# EAGLE design koppelpunkt (EAGLE 7.3.0)
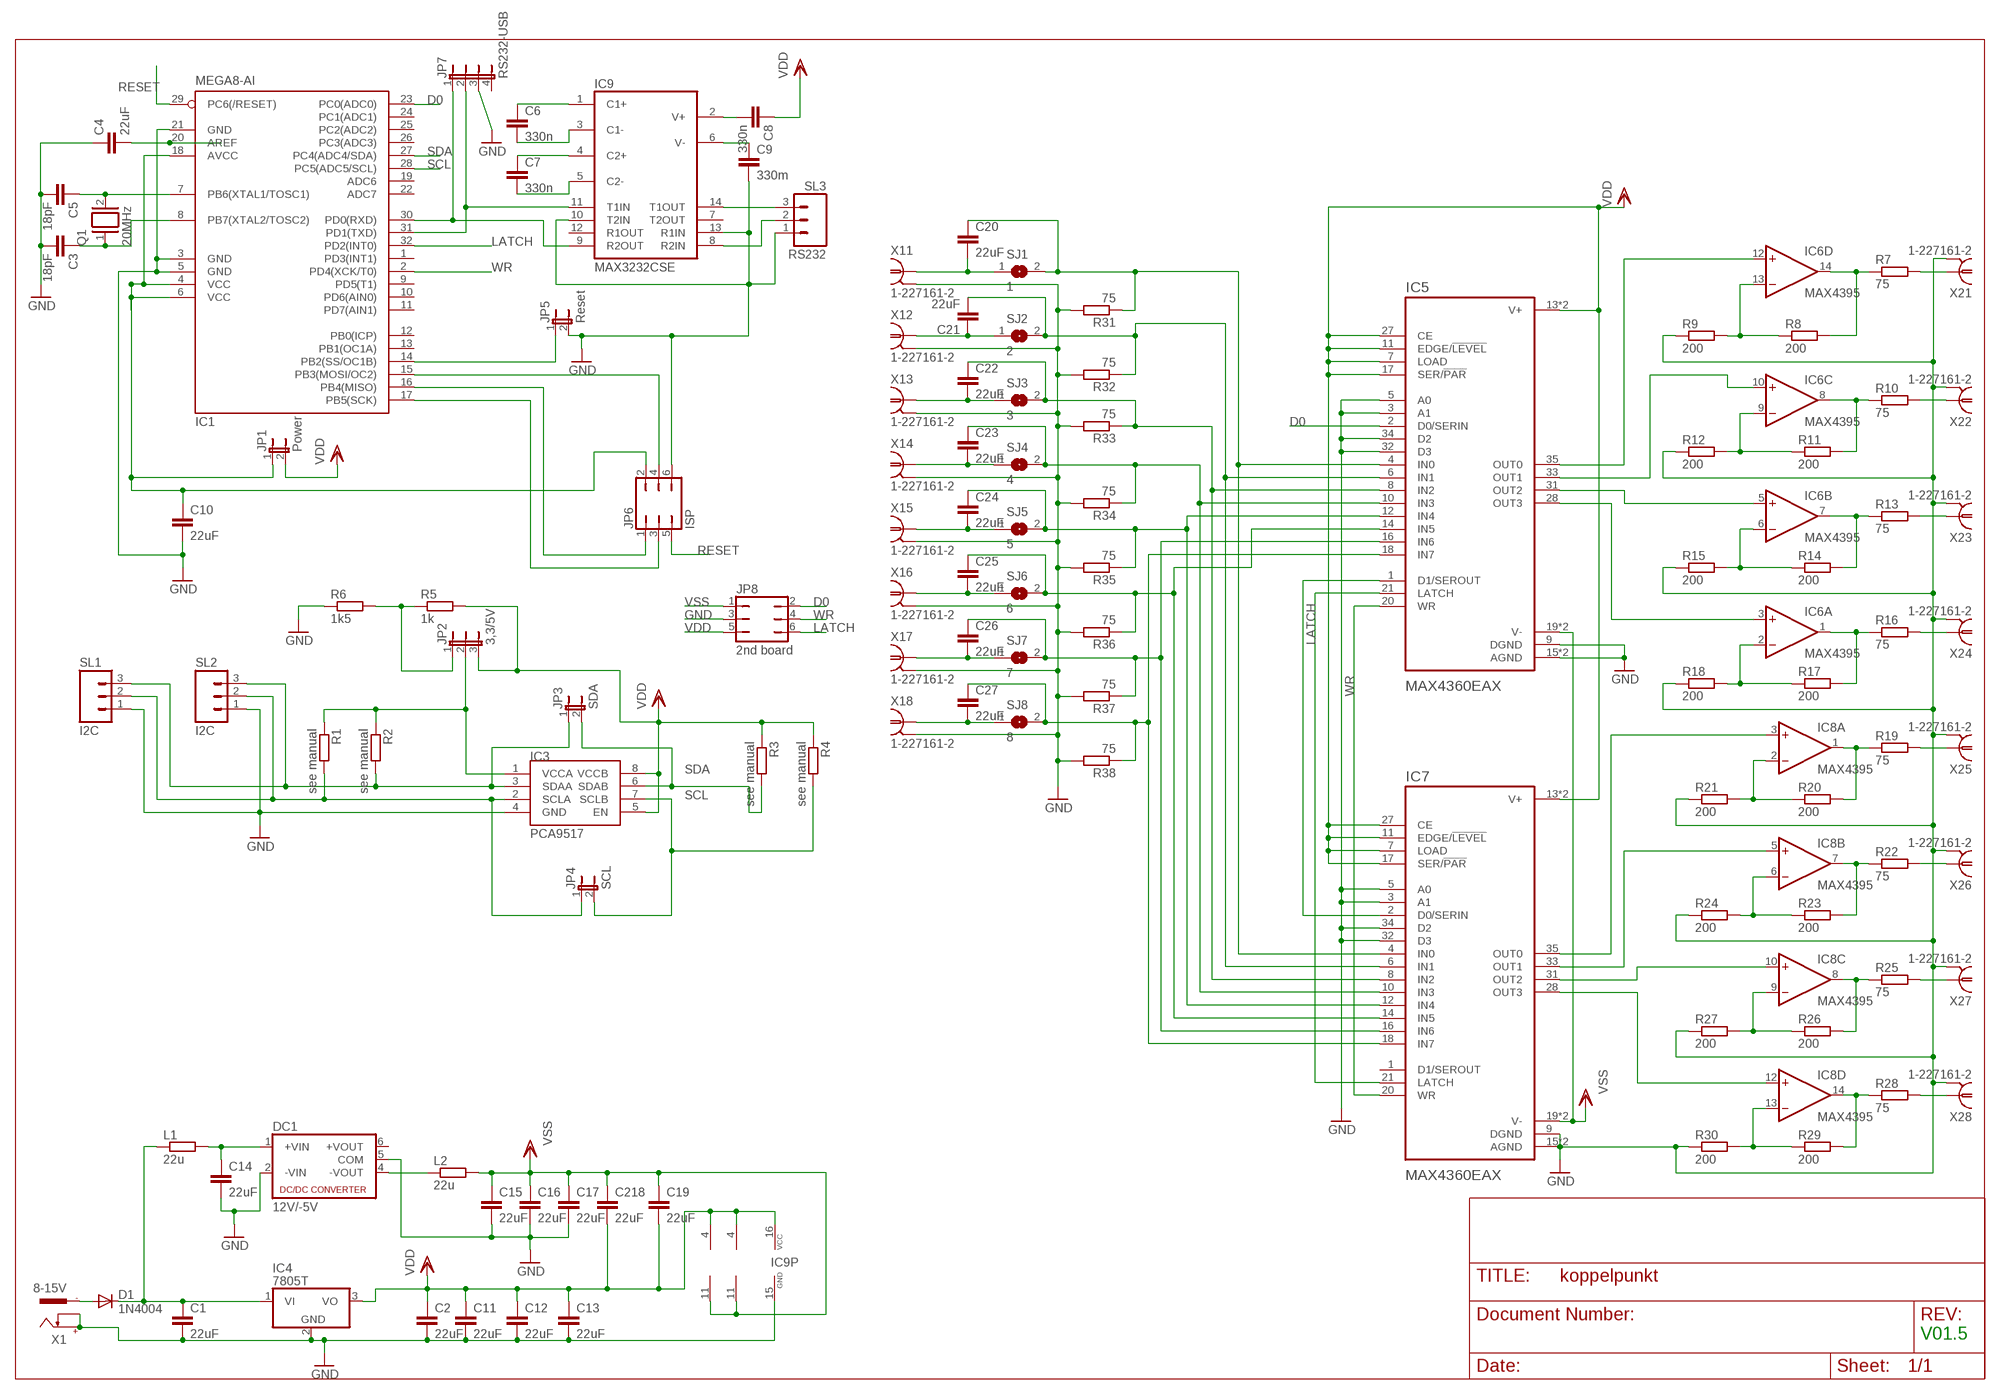
[diagram p0: schematic, sheet 1]

## Parts
C1  22uF  C-EUC1206  [C1206]
C2  22uF  C-EUC1206  [C1206]
C3  18pF  C-EU025-025X050  [C025-025X050]
C4  22uF  C-EUC1206  [C1206]
C5  18pF  C-EU025-025X050  [C025-025X050]
C6  330n  C-EUC1206  [C1206]
C7  330n  C-EUC1206  [C1206]
C8  330n  C-EUC1206  [C1206]
C9  330m  C-EUC1206  [C1206]
C10  22uF  C-EUC1206  [C1206]
C11  22uF  C-EUC1206  [C1206]
C12  22uF  C-EUC1206  [C1206]
C13  22uF  C-EUC1206  [C1206]
C14  22uF  C-EUC1206  [C1206]
C15  22uF  C-EUC1206  [C1206]
C16  22uF  C-EUC1206  [C1206]
C17  22uF  C-EUC1206  [C1206]
C19  22uF  C-EUC1206  [C1206]
C20  22uF  C-EUC1206  [C1206]
C21  22uF  C-EUC1206  [C1206]
C22  22uF  C-EUC1206  [C1206]
C23  22uF  C-EUC1206  [C1206]
C24  22uF  C-EUC1206  [C1206]
C25  22uF  C-EUC1206  [C1206]
C26  22uF  C-EUC1206  [C1206]
C27  22uF  C-EUC1206  [C1206]
C218  22uF  C-EUC1206  [C1206]
D1  1N4004  [DO41-10]
DC1  12V/-5V  NMA  [NMA]
IC1  MEGA8-AI  [TQFP32-08]
IC3  PCA9517  [SO-08]
IC4  7805T  [TO220H]
IC5  MAX4360EAX  [SOP80P1030X264-36N]
IC6  MAX4395  LM324D  [SO14]
IC7  MAX4360EAX  [SOP80P1030X264-36N]
IC8  MAX4395  LM324D  [SO14]
IC9  MAX3232CSE  [SO16]
JP1  Power  JP1E  [JP1]
JP2  3,3/5V  JP2E  [JP2]
JP3  SDA  JP1E  [JP1]
JP4  SCL  JP1E  [JP1]
JP5  Reset  JP1E  [JP1]
JP6  ISP  JP3Q  [JP3Q]
JP7  RS232-USB  JP4E  [JP4]
JP8  2nd board  JP3Q  [JP3Q]
L1  22u  R-EU_R6332  [R6332]
L2  22u  R-EU_R6332  [R6332]
Q1  20MHz  XTAL/S  [QS]
R1  see manual  R-EU_R1206  [R1206]
R2  see manual  R-EU_R1206  [R1206]
R3  see manual  R-EU_R1206  [R1206]
R4  see manual  R-EU_R1206  [R1206]
R5  1k  R-EU_R1206  [R1206]
R6  1k5  R-EU_R1206  [R1206]
R7  75  R-EU_R1206  [R1206]
R8  200  R-EU_R1206  [R1206]
R9  200  R-EU_M1206  [M1206]
R10  75  R-EU_R1206  [R1206]
R11  200  R-EU_R1206  [R1206]
R12  200  R-EU_R1206  [R1206]
R13  75  R-EU_R1206  [R1206]
R14  200  R-EU_R1206  [R1206]
R15  200  R-EU_R1206  [R1206]
R16  75  R-EU_R1206  [R1206]
R17  200  R-EU_R1206  [R1206]
R18  200  R-EU_R1206  [R1206]
R19  75  R-EU_R1206  [R1206]
R20  200  R-EU_R1206  [R1206]
R21  200  R-EU_R1206  [R1206]
R22  75  R-EU_R1206  [R1206]
R23  200  R-EU_R1206  [R1206]
R24  200  R-EU_R1206  [R1206]
R25  75  R-EU_R1206  [R1206]
R26  200  R-EU_R1206  [R1206]
R27  200  R-EU_R1206  [R1206]
R28  75  R-EU_R1206  [R1206]
R29  200  R-EU_R1206  [R1206]
R30  200  R-EU_R1206  [R1206]
R31  75  R-EU_R1206  [R1206]
R32  75  R-EU_R1206  [R1206]
R33  75  R-EU_R1206  [R1206]
R34  75  R-EU_R1206  [R1206]
R35  75  R-EU_R1206  [R1206]
R36  75  R-EU_R1206  [R1206]
R37  75  R-EU_R1206  [R1206]
R38  75  R-EU_R1206  [R1206]
SJ1  1  SJ  [SJ]
SJ2  2  SJ  [SJ]
SJ3  3  SJ  [SJ]
SJ4  4  SJ  [SJ]
SJ5  5  SJ  [SJ]
SJ6  6  SJ  [SJ]
SJ7  7  SJ  [SJ]
SJ8  8  SJ  [SJ]
SL1  I2C  M03  [03P]
SL2  I2C  M03  [03P]
SL3  RS232  M03  [03P]
X1  8-15V  737992-55  [737992-5]
X11  1-227161-2  [AMP_227161]
X12  1-227161-2  [AMP_227161]
X13  1-227161-2  [AMP_227161]
X14  1-227161-2  [AMP_227161]
X15  1-227161-2  [AMP_227161]
X16  1-227161-2  [AMP_227161]
X17  1-227161-2  [AMP_227161]
X18  1-227161-2  [AMP_227161]
X21  1-227161-2  [AMP_227161]
X22  1-227161-2  [AMP_227161]
X23  1-227161-2  [AMP_227161]
X24  1-227161-2  [AMP_227161]
X25  1-227161-2  [AMP_227161]
X26  1-227161-2  [AMP_227161]
X27  1-227161-2  [AMP_227161]
X28  1-227161-2  [AMP_227161]

## Nets
D0: IC1.23(PC0(ADC0)) IC5.2(D0/SERIN) JP8.2
GND: C1.2 C2.2 C3.2 C4.1 C5.2 C9.2 C10.2 C11.2 C12.2 C13.2 C14.2 C15.2 C16.2 C17.2 DC1.2(-VIN) DC1.5(COM) IC1.3(GND) IC1.5(GND) IC1.21(GND) IC3.4(GND) IC4.2(GND) IC5.3(A1) IC5.5(A0) IC5.9(DGND) IC5.15(AGND) IC5.29(AGND) IC5.32(D3) IC5.34(D2) IC7.3(A1) IC7.5(A0) IC7.9(DGND) IC7.15(AGND) IC7.29(AGND) IC7.32(D3) IC7.34(D2) IC9.10(T2IN) IC9.13(R1IN) IC9.15(GND) JP5.2 JP6.6 JP7.3 JP8.3 R6.1 R9.1 R12.1 R15.1 R18.1 R21.1 R24.1 R27.1 R30.1 R31.2 R32.2 R33.2 R34.2 R35.2 R36.2 R37.2 R38.2 SL1.1 SL2.1 SL3.1 X1.+ X1.K X11.2 X12.2 X13.2 X14.2 X15.2 X16.2 X17.2 X18.2 X21.2 X22.2 X23.2 X24.2 X25.2 X26.2 X27.2 X28.2
LATCH: IC1.32(PD2(INT0)) IC5.21(LATCH) IC7.21(LATCH) JP8.6
N$1: C23.1 IC5.10(IN3) IC7.10(IN3) R34.1 SJ4.2
N$2: C5.1 IC1.7(PB6(XTAL1/TOSC1)) Q1.2
N$3: C3.1 IC1.8(PB7(XTAL2/TOSC2)) Q1.1
N$4: C4.2 IC1.20(AREF)
N$5: IC3.3(SDAA) JP3.1 R2.2 SL1.3 SL2.3
N$6: IC1.16(PB4(MISO)) JP6.1
N$7: D1.A X1.-1
N$8: C10.1 IC1.4(VCC) IC1.6(VCC) IC1.18(AVCC) JP1.1 JP6.2
N$9: IC1.17(PB5(SCK)) JP6.3
N$10: IC1.14(PB2(SS/OC1B)) JP5.1
N$11: IC1.15(PB3(MOSI/OC2)) JP6.4
N$12: C7.2 IC9.5(C2-)
N$13: IC3.1(VCCA) JP2.2 R1.1 R2.1
N$14: IC3.2(SCLA) JP4.1 R1.2 SL1.2 SL2.2
N$15: IC9.14(T1OUT) SL3.3
N$16: C8.2 IC9.2(V+)
N$17: C22.1 IC5.8(IN2) IC7.8(IN2) R33.1 SJ3.2
N$18: R7.2 X21.1
N$19: IC6.14(D:OUT) R7.1 R8.2
N$20: IC9.8(R2IN) SL3.2
N$21: IC6.13(D:-IN) R8.1 R9.2
N$22: C7.1 IC9.4(C2+)
N$23: R10.2 X22.1
N$25: JP2.1 R5.1 R6.2
N$26: IC6.8(C:OUT) R10.1 R11.2
N$27: IC6.9(C:-IN) R11.1 R12.2
N$28: R13.2 X23.1
N$29: C9.1 IC9.6(V-)
N$30: IC5.1(D1/SEROUT) IC7.2(D0/SERIN)
N$31: IC6.7(B:OUT) R13.1 R14.2
N$32: IC6.6(B:-IN) R14.1 R15.2
N$33: C1.1 D1.C IC4.1(VI) L1.1
N$34: IC1.30(PD0(RXD)) IC9.9(R2OUT) JP7.1
N$35: R22.2 X26.1
N$36: IC8.7(B:OUT) R22.1 R23.2
N$37: IC8.6(B:-IN) R23.1 R24.2
N$38: IC6.1(A:OUT) R16.1 R17.2
N$39: R16.2 X24.1
N$40: IC6.2(A:-IN) R17.1 R18.2
N$41: IC8.9(C:-IN) R26.1 R27.2
N$42: IC8.2(A:-IN) R20.1 R21.2
N$43: IC8.1(A:OUT) R19.1 R20.2
N$44: IC1.31(PD1(TXD)) IC9.11(T1IN) JP7.2
N$45: R19.2 X25.1
N$46: R25.2 X27.1
N$47: IC8.8(C:OUT) R25.1 R26.2
N$48: C6.1 IC9.1(C1+)
N$49: R28.2 X28.1
N$50: IC8.14(D:OUT) R28.1 R29.2
N$51: IC8.13(D:-IN) R29.1 R30.2
N$52: C6.2 IC9.3(C1-)
N$53: IC5.35(OUT0) IC6.12(D:+IN)
N$54: IC5.33(OUT1) IC6.10(C:+IN)
N$55: IC5.31(OUT2) IC6.5(B:+IN)
N$56: IC5.28(OUT3) IC6.3(A:+IN)
N$57: C14.1 DC1.1(+VIN) L1.2
N$58: IC7.35(OUT0) IC8.3(A:+IN)
N$59: C20.2 SJ1.1 X11.1
N$60: C26.1 IC5.16(IN6) IC7.16(IN6) R37.1 SJ7.2
N$61: IC7.33(OUT1) IC8.5(B:+IN)
N$62: IC7.31(OUT2) IC8.10(C:+IN)
N$63: IC7.28(OUT3) IC8.12(D:+IN)
N$64: C21.1 SJ2.1 X12.1
N$65: C22.2 SJ3.1 X13.1
N$66: C20.1 IC5.4(IN0) IC7.4(IN0) R31.1 SJ1.2
N$67: C21.2 IC5.6(IN1) IC7.6(IN1) R32.1 SJ2.2
N$68: C23.2 SJ4.1 X14.1
N$69: C24.2 SJ5.1 X15.1
N$70: C24.1 IC5.12(IN4) IC7.12(IN4) R35.1 SJ5.2
N$71: C25.2 SJ6.1 X16.1
N$73: C26.2 SJ7.1 X17.1
N$74: C27.2 SJ8.1 X18.1
N$75: C27.1 IC5.18(IN7) IC7.18(IN7) R38.1 SJ8.2
N$76: DC1.4(-VOUT) L2.1
N$77: C25.1 IC5.14(IN5) IC7.14(IN5) R36.1 SJ6.2
RESET: IC1.29(PC6(/RESET)) JP6.5
SCL: IC1.28(PC5(ADC5/SCL)) IC3.7(SCLB) JP4.2 R4.2
SDA: IC1.27(PC4(ADC4/SDA)) IC3.6(SDAB) JP3.2 R3.2
VDD: C2.1 C8.1 C11.1 C12.1 C13.1 C19.2 C218.2 IC3.5(EN) IC3.8(VCCB) IC4.3(VO) IC5.7(LOAD) IC5.11(EDGE/!LEVEL) IC5.13(V+) IC5.17(SER/!PAR) IC5.27(CE) IC5.36(V+) IC6.4(P:V+) IC7.7(LOAD) IC7.11(EDGE/!LEVEL) IC7.13(V+) IC7.17(SER/!PAR) IC7.27(CE) IC7.36(V+) IC8.4(P:V+) IC9.16(VCC) JP1.2 JP2.3 JP8.5 R3.1 R4.1 R5.2
VSS: C15.1 C16.1 C17.1 C19.1 C218.1 IC5.19(V-) IC5.30(V-) IC6.11(P:V-) IC7.19(V-) IC7.30(V-) IC8.11(P:V-) JP8.1 L2.2
WR: IC1.2(PD4(XCK/T0)) IC5.20(WR) IC7.20(WR) JP8.4
Unconnected: DC1.6(+VOUT) IC1.1(PD3(INT1)) IC1.9(PD5(T1)) IC1.10(PD6(AIN0)) IC1.11(PD7(AIN1)) IC1.12(PB0(ICP)) IC1.13(PB1(OC1A)) IC1.19(ADC6) IC1.22(ADC7) IC1.24(PC1(ADC1)) IC1.25(PC2(ADC2)) IC1.26(PC3(ADC3)) IC7.1(D1/SEROUT) IC9.7(T2OUT) IC9.12(R1OUT) JP7.4 X1.-2

## Notes on the sheet
- V01.5

## Library data of the parts
C1 C2 C4 C6-C17 C19-C27 C218 = rcl:C-EU: CAPACITOR, European symbol
C3 C5 = resistor:C-EU: CAPACITOR, European symbol
D1 = diode:1N4004: DIODE general purpose rectifier, 1 A
DC1 = dc-dc-converter:NMA: DC-DC CONVERTER; MF: C & D TECHNOLOGIES, INC; MPN: NMA0515SC; OC_FARNELL: 1021434; OC_NEWARK: 61K3064
IC1 = atmel:MEGA8: MICROCONTROLLER 8 Kbytes FLASH, 1 kbytes SRAM, 512 bytes EEPROM, USART, 6-channel 10 bit ADC, 2-channel 8 bit ADC Pin compatible with Atmega48, ATMega88, ATMega168 Source: avr.lbr; MPN: ATMEGA8-16AU; OC_FARNELL: 9171371; OC_NEWARK: 73M8863
IC3 = PCA9517:PCA9517: PCA9517
IC4 = linear:78*: Positive VOLTAGE REGULATOR Source: http://cache.national.com/ds/LM/LM78L05.pdf http://www.fairchildsemi.com/ds/LM/LM7805.pdf
IC5 IC7 = MAX4360EAX:MAX4360EAX: Video Switch IC 1 Channel 36-SSOP; AVAILABILITY: Unavailable; DESCRIPTION: Video Switch IC 1 Channel 36-SSOP; MF: Maxim Integrated; MP: MAX4360EAX; PACKAGE: SSOP-36 Maxim Integrated; PRICE: None
IC6 IC8 = linear:LM324: OP AMP
IC9 = maxim:MAX3232*: True RS-232 Transceivers 3.0V to 5.5V, Low-Power up to 1Mbps, Using Four 0.1µF External Capacitors Source: http://pdfserv.maxim-ic.com/en/ds/MAX3222-MAX3241.pdf; MPN: MAX3232CSE; OC_FARNELL: 9725490; OC_NEWARK: 90C2890
JP1 JP3-JP5 = jumper:JP1E: JUMPER
JP2 = jumper:JP2E: JUMPER
JP6 JP8 = jumper:JP3Q: JUMPER
JP7 = jumper:JP4E: JUMPER
L1 L2 R1-R4 R7-R38 = resistor:R-EU_: RESISTOR, European symbol
Q1 = special:XTAL/S: CRYSTAL
R5 R6 = rcl:R-EU_: RESISTOR, European symbol
SJ1-SJ8 = jumper:SJ: SMD solder JUMPER
SL1-SL3 = con-amp-quick:M03: AMP QUICK CONNECTOR; OC_FARNELL: unknown; OC_NEWARK: unknown
X1 = con-conrad:737992-55: FEMALE PRINT CONNECTOR DIN 45323 (34V/3A), ROKA, distributor Conrad
X11-X18 X21-X28 = con-coax:?227161*: JACK, RIGHT ANGLE, 50 OHM, PCB, BNC Source: amp_227161.pdf; OC_FARNELL: unknown; OC_NEWARK: unknown

## Board
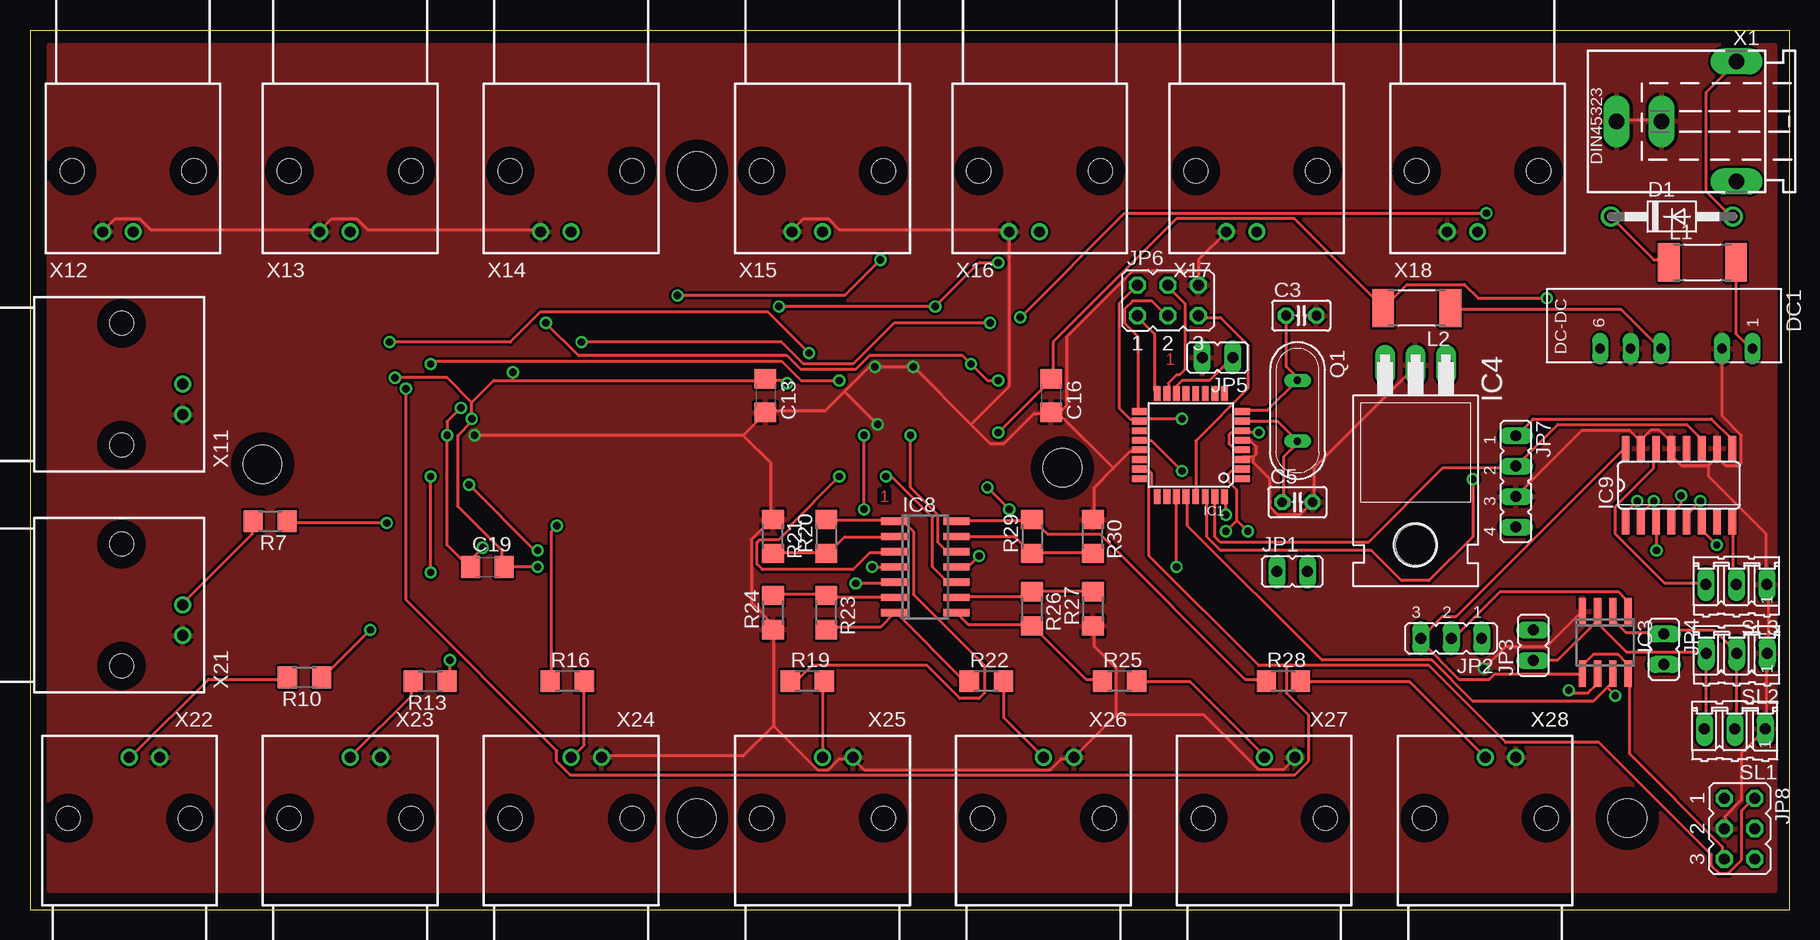
[diagram p1: board, top side]
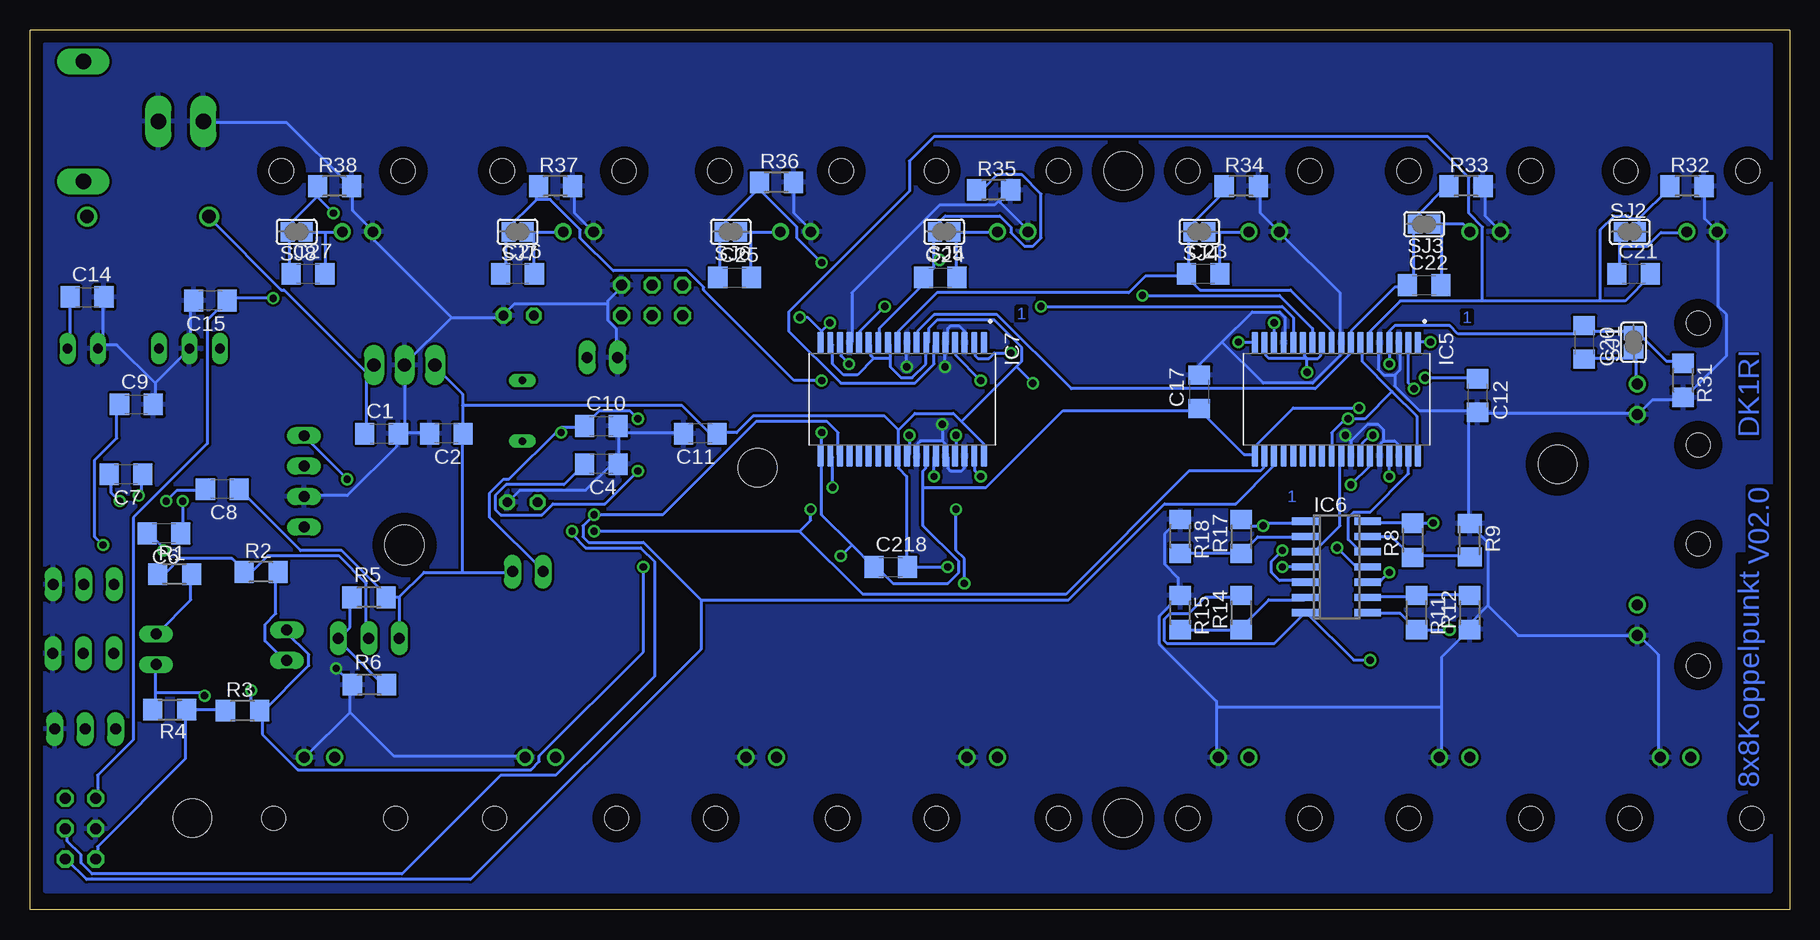
[diagram p2: board, bottom side, seen from below]

Size 146.71 x 73.36 mm. Coordinates in mm from the lower left corner, seen from the top.
Outline: 146.71,73.34 146.69,0 0,0.01 0.02,36.84 0.02,73.36 146.71,73.36
Copper layers (1*2*16): Top 0.035mm / dielectric 1.5mm / signal2 0.035mm / dielectric 0.15mm / Bottom 0.035mm
Design rules "default *": minimum track width 10mil, minimum drill 24mil, track to track 8mil, track to pad 8mil, pad to pad 8mil, via to via 8mil, smd to smd 8mil, copper to edge 40mil, drill to drill 8mil, minimum pad ring 10mil, minimum via ring 8mil, stop-mask expansion 4mil, vias tented up to drill 0mil, thermal gap 10mil
Holes 3.2 mm at 19.39,37.16 86.06,36.84 133.15,7.63 55.58,61.61 55.58,7.63

### Footprints (pad centres in the part's own frame; a part is rotated, then mirrored left to right if it is on the bottom)
C1206 = smd 1.6 x 1.8: 1 -1.4,0; 2 1.4,0
C025-025X050 = drill 0.813 octagon: 1 -1.27,0; 2 1.27,0
DO41-10 = drill 1.118: A 5.08,0; C -5.08,0
NMA = drill 0.813 long: 1 0,6.35; 2 0,3.81; 4 0,-1.27; 5 0,-3.81; 6 0,-6.35
TQFP32-08 = smd 1.27 x 0.559: 1 -4.293,2.8; 2 -4.293,2; 3 -4.293,1.2; 4 -4.293,0.4; 5 -4.293,-0.4; 6 -4.293,-1.2; 7 -4.293,-2; 8 -4.293,-2.8; 17 4.293,-2.8; 18 4.293,-2; 19 4.293,-1.2; 20 4.293,-0.4; 21 4.293,0.4; 22 4.293,1.2; 23 4.293,2; 24 4.293,2.8 | smd 0.559 x 1.27: 9 -2.8,-4.293; 10 -2,-4.293; 11 -1.2,-4.293; 12 -0.4,-4.293; 13 0.4,-4.293; 14 1.2,-4.293; 15 2,-4.293; 16 2.8,-4.293; 25 2.8,4.293; 26 2,4.293; 27 1.2,4.293; 28 0.4,4.293; 29 -0.4,4.293; 30 -1.2,4.293; 31 -2,4.293; 32 -2.8,4.293
SO-08 = smd 0.6 x 2.2: 1 -1.905,-2.6; 2 -0.635,-2.6; 3 0.635,-2.6; 4 1.905,-2.6; 5 1.905,2.6; 6 0.635,2.6; 7 -0.635,2.6; 8 -1.905,2.6
TO220H = drill 1.118 long: 1 -2.54,-10.16; 2 0,-10.16; 3 2.54,-10.16 | hole 3.302: 0,4.826
SOP80P1030X264-36N = smd 1.79 x 0.54: 1 -4.72,6.8; 2 -4.72,6; 3 -4.72,5.2; 4 -4.72,4.4; 5 -4.72,3.6; 6 -4.72,2.8; 7 -4.72,2; 8 -4.72,1.2; 9 -4.72,0.4; 10 -4.72,-0.4; 11 -4.72,-1.2; 12 -4.72,-2; 13 -4.72,-2.8; 14 -4.72,-3.6; 15 -4.72,-4.4; 16 -4.72,-5.2; 17 -4.72,-6; 18 -4.72,-6.8; 19 4.72,-6.8; 20 4.72,-6; 21 4.72,-5.2; 22 4.72,-4.4; 23 4.72,-3.6; 24 4.72,-2.8; 25 4.72,-2; 26 4.72,-1.2; 27 4.72,-0.4; 28 4.72,0.4; 29 4.72,1.2; 30 4.72,2; 31 4.72,2.8; 32 4.72,3.6; 33 4.72,4.4; 34 4.72,5.2; 35 4.72,6; 36 4.72,6.8
SO14 = smd 0.6 x 2.2: 1 -3.81,-2.6; 2 -2.54,-2.6; 3 -1.27,-2.6; 4 0,-2.6; 5 1.27,-2.6; 6 2.54,-2.6; 7 3.81,-2.6; 8 3.81,2.6; 9 2.54,2.6; 10 1.27,2.6; 11 0,2.6; 12 -1.27,2.6; 13 -2.54,2.6; 14 -3.81,2.6
SO16 = smd 0.66 x 2.032: 1 -4.445,-3.073; 2 -3.175,-3.073; 3 -1.905,-3.073; 4 -0.635,-3.073; 5 0.635,-3.073; 6 1.905,-3.073; 7 3.175,-3.073; 8 4.445,-3.073; 9 4.445,3.073; 10 3.175,3.073; 11 1.905,3.073; 12 0.635,3.073; 13 -0.635,3.073; 14 -1.905,3.073; 15 -3.175,3.073; 16 -4.445,3.073
JP1 = drill 0.914 long: 1 0,-1.27; 2 0,1.27
JP2 = drill 0.914 long: 1 -2.54,0; 2 0,0; 3 2.54,0
JP3Q = drill 0.914 octagon: 1 -2.54,-1.27; 2 -2.54,1.27; 3 0,-1.27; 4 0,1.27; 5 2.54,-1.27; 6 2.54,1.27
JP4 = drill 0.914 long: 1 -3.81,0; 2 -1.27,0; 3 1.27,0; 4 3.81,0
R6332 = smd 1.8 x 3.2: 1 -2.8,0; 2 2.8,0
QS = drill 0.61 long: 1 -2.54,0; 2 2.54,0
R1206 = smd 1.6 x 1.803: 1 -1.422,0; 2 1.422,0
M1206 = smd 1.6 x 2: 1 -1.4,0; 2 1.4,0
SJ = smd 1.168 x 1.6: 1 -0.762,0; 2 0.762,0
03P = drill 0.914 long: 1 -2.54,0; 2 0,0; 3 2.54,0
737992-5 = drill 1.3 pad 2.184 long: + 0,10; -1 5,0; -2 -5,0; K 0,6.25
AMP_227161 = drill 0.9 pad 1.27: 1 0,-5.08; 2 -2.54,-5.08 | hole 2: -5.08,0; 5.08,0

### Placement (x,y rotation side)
C1  117.4,39.7 0 bottom
C2  112,39.7 180 bottom
C3  105.97,49.54 0 top
C4  99.08,37.16 180 bottom
C5  105.65,33.98 0 top
C6  135.53,31.38 180 bottom
C7  138.71,36.3 180 bottom
C8  130.67,35.07 180 bottom
C9  137.84,42.15 0 bottom
C10  99.08,40.34 0 bottom
C11  90.83,39.7 180 bottom
C12  26.05,42.88 270 bottom
C13  61.3,42.88 270 top
C14  141.95,51.1 0 bottom
C15  131.67,50.79 180 bottom
C16  85.11,42.88 270 top
C17  49.23,43.19 90 bottom
C19  38.12,28.59 0 top
C20  17.16,47.32 270 bottom
C21  13.04,53.04 0 bottom
C22  30.5,52.08 0 bottom
C23  48.92,53.04 0 bottom
C24  70.82,52.72 0 bottom
C25  87.97,52.72 0 bottom
C26  106.06,53.04 0 bottom
C27  123.53,53.04 0 bottom
C218  74.95,28.59 0 bottom
D1  136.86,57.8 0 top
DC1  137.23,46.79 270 top
IC1  96.76,38.75 180 top
IC3  131.31,22.29 180 top
IC4  115.49,35.26 180 top
IC5  37.8,42.56 270 bottom
IC6  37.8,28.59 270 bottom
IC7  74,42.56 270 bottom
IC8  74.63,28.59 270 top
IC9  137.45,35.4 0 top
JP1  105.21,28.2 270 top
JP2  118.46,22.63 180 top
JP3  125.3,22.05 0 top
JP4  136.2,21.73 180 top
JP5  98.98,46.05 90 top
JP6  94.86,50.81 0 top
JP7  123.86,35.71 270 top
JP8  142.51,6.77 270 top
L1  139.4,53.99 0 top
L2  115.59,50.17 180 top
Q1  105.65,41.61 270 top
R1  134.64,27.98 0 bottom
R2  127.43,28.17 0 bottom
R3  128.99,16.59 0 bottom
R4  135.05,16.68 180 bottom
R5  118.45,26.05 0 bottom
R6  118.4,18.76 0 bottom
R7  20.02,32.4 180 top
R8  31.45,30.81 90 bottom
R9  26.69,30.81 270 bottom
R10  22.88,19.38 180 top
R11  31.13,24.78 270 bottom
R12  26.69,24.78 90 bottom
R13  33.36,19.06 180 top
R14  45.74,24.78 90 bottom
R15  50.82,24.78 270 bottom
R16  44.79,19.06 0 top
R17  45.74,31.13 90 bottom
R18  50.82,31.13 270 bottom
R19  64.79,19.06 0 top
R20  66.38,31.13 90 top
R21  61.93,31.13 270 top
R22  79.71,19.06 0 top
R23  66.38,24.78 270 top
R24  61.93,24.78 90 top
R25  90.83,19.06 0 top
R26  83.52,25.09 270 top
R27  88.6,25.09 90 top
R28  104.48,19.06 0 top
R29  83.52,31.13 90 top
R30  88.6,31.13 270 top
R31  8.91,44.15 270 bottom
R32  8.59,60.34 0 bottom
R33  27.01,60.34 0 bottom
R34  45.74,60.34 0 bottom
R35  66.38,60.02 0 bottom
R36  84.47,60.66 0 bottom
R37  102.89,60.34 0 bottom
R38  121.3,60.34 0 bottom
SJ1  13.04,47.32 90 bottom
SJ2  13.36,56.53 0 bottom
SJ3  30.5,57.16 180 bottom
SJ4  49.23,56.53 180 bottom
SJ5  70.5,56.53 180 bottom
SJ6  88.28,56.53 180 bottom
SJ7  106.06,56.53 180 bottom
SJ8  124.48,56.53 180 bottom
SL1  142.11,15.07 180 top
SL2  142.26,21.38 180 top
SL3  142.25,27.14 180 top
X1  142.26,65.73 90 top
X11  7.64,43.83 90 top
X12  8.59,61.61 0 top
X13  26.69,61.61 0 top
X14  45.11,61.61 0 top
X15  66.06,61.61 0 top
X16  84.16,61.61 0 top
X17  102.25,61.61 0 top
X18  120.67,61.61 0 top
X21  7.64,25.41 90 top
X22  8.28,7.63 180 top
X23  26.69,7.63 180 top
X24  45.11,7.63 180 top
X25  66.06,7.63 180 top
X26  84.47,7.63 180 top
X27  102.89,7.63 180 top
X28  121.3,7.63 180 top

### Tracks (layer width: path | path; a pad name or v marks a point on that pad's centre or on a via)
D0  (via drill 0.61)
  Top 0.254: 104.72,20.36 116.61,20.36 123.01,13.96 130.78,13.96 140.15,4.58 140.15,3.67 140.84,2.98 141.52,2.98 142.67,4.13 142.67,8.24 143.58,9.16 JP8.2 | 104.72,20.36 102.43,20.36 93.29,29.5 93.29,35.22 93.52,35.45 93.52,36.36 93.29,36.59 92.6,36.59 IC1.23 | v31.34,43.45 31.34,25.84 43.91,13.27 43.91,12.36 45.05,11.21 105.41,11.21 106.55,12.36 106.55,16.24 104.72,18.07 104.72,20.36
  Bottom 0.254: v31.34,43.45 31.79,43.9 31.79,47.1 IC5.2
GND  (via drill 0.61)
  Top 0.254: JP8.3 141.3,6.87 141.3,7.78 142.67,9.16 142.67,13.04 144.5,14.87 SL1.1 144.72,15.1 144.72,21.27 SL2.1 144.95,21.5 144.95,26.99 SL3.1 144.72,27.22 144.72,31.33 139.92,36.13 139.92,37.05 | 134.44,39.33 134.44,38.65 IC9.15 134.44,39.33 | 134.44,39.33 135.12,40.02 135.81,40.02 136.72,39.1 136.72,38.65 IC9.13 136.95,38.42 136.95,37.73 137.64,37.05 139.92,37.05 | 140.61,37.73 140.61,38.42 IC9.10 140.61,37.73 | 139.92,37.05 140.61,37.73 | 140.61,37.73 141.3,37.05 142.44,37.05 142.67,37.27 142.67,39.56 141.07,41.16 141.07,46.65 DC1.2 | 101.98,37.73 101.06,37.73 IC1.3 | 101.98,37.73 102.2,37.96 102.2,38.65 101.75,39.1 101.06,39.1 IC1.5 | 101.98,37.73 101.98,37.27 103.35,35.9 103.35,33.62 104.03,32.93 105.86,32.93 106.78,33.85 C5.2 107,34.07 107,36.82 115.46,45.28 IC4.2 | 97.4,53.28 97.4,54.19 99.69,56.48 X17.2 | 97.4,53.28 97.4,52.13 JP6.6 | X1.+ 132.38,65.85 135.81,65.85 X1.K | 134.44,39.33 133.98,39.33 133.29,40.02 129.41,40.02 123.92,34.53 JP7.3 | X12.2 6.19,56.71 7.11,57.62 9.16,57.62 10.08,56.71 24.02,56.71 X13.2 24.25,56.71 25.17,57.62 27.22,57.62 28.14,56.71 42.54,56.71 X14.2 | 90.55,16.24 90.55,20.13 88.72,21.96 88.72,23.56 R27.1 | 90.55,16.24 X26.2 86.89,12.59 85.97,12.59 85.06,11.67 69.51,11.67 68.6,12.59 | v121.18,20.13 123.01,21.96 126.44,21.96 129.18,24.7 IC3.4 | 90.55,16.24 97.86,16.24 102.43,11.67 104.49,11.67 105.41,12.59 X27.2 | 68.6,12.59 67.46,12.59 66.54,11.67 65.63,11.67 61.97,15.33 | 61.97,15.33 61.97,23.33 R24.1 61.74,23.56 61.74,24.02 60.14,25.62 60.14,30.87 61.74,32.47 R21.1 61.74,32.7 61.74,37.27 59.46,39.56 | 61.97,15.33 59.46,12.81 47.8,12.81 X24.2
  Top 0.254: X15.2 63.57,56.71 64.48,57.62 66.54,57.62 67.46,56.71 81.4,56.71 X16.2 81.63,56.48 81.63,43.68 78.43,40.47 | 90.32,36.82 88.72,35.22 88.72,32.7 R30.1 | 90.32,36.82 91.69,38.19 92.37,38.19 IC1.21 | 85.74,41.39 85.29,41.39 C16.2 | 90.32,36.82 85.74,41.39 | 67.91,43.22 66.31,41.62 61.51,41.62 C13.2 61.29,41.39 59.46,39.56 | 67.91,43.22 69.97,45.28 v70.43,45.28 v73.63,45.28 78.43,40.47 | 67.91,43.22 v70.66,40.47 | 59.46,39.56 v37.05,39.56 | 78.43,40.47 80.03,38.87 81.17,38.87 83.69,41.39 85.06,41.39 C16.2 | 68.6,12.59 X25.2 | 97.4,53.28 91.92,53.28 86.43,47.79 86.43,42.07 85.74,41.39 | 85.74,41.39 C16.2
  Bottom 0.254: 140.61,47.1 140.61,50.99 C14.2 | 140.61,47.1 140.84,46.88 DC1.2 140.61,47.1 | 136.27,43.9 136.27,42.3 C9.2 | 136.27,43.9 133.52,46.65 DC1.5 133.29,46.88 133.29,50.76 C15.2 | 140.61,47.1 139.47,47.1 136.27,43.9 | 97.63,39.79 97.63,40.25 C10.2 97.63,39.79 | 97.63,39.79 97.63,37.27 C4.1 97.86,37.05 98.32,37.05 100.38,34.99 105.86,34.99 106.78,34.07 C5.2 | 97.63,39.79 92.37,39.79 C11.2 | R37.2 101.29,60.13 101.29,58.08 99.92,56.71 X17.2 | 98.55,50.53 98.55,50.76 97.4,51.9 JP6.6 | 98.55,50.53 98.55,49.16 97.86,48.48 97.86,46.19 JP5.2 | 115.46,39.79 115.92,39.79 C1.2 | 115.46,39.79 113.41,39.79 C2.2 | 111.58,49.39 107.46,49.39 C3.2 107.23,49.62 106.32,50.53 98.55,50.53 | 111.58,49.39 115.46,45.5 IC4.2 115.46,45.28 115.46,39.79 | 115.46,39.79 C1.2 | JP7.3 123.69,34.53 120.26,34.53 116.15,38.65 116.15,39.56 C1.2 | 111.58,49.39 117.98,55.79 117.98,56.48 X18.2 118.21,56.71 119.81,58.31 119.81,60.13 R38.2 120.03,60.36 125.29,65.62 132.15,65.62 X1.+ | X22.2 10.99,12.81 10.99,21.27 12.59,22.87 X21.2 22.65,22.87 25.17,25.39 | 32.94,44.59 32.48,45.05 32.48,47.1 IC5.3 | 32.94,44.59 33.85,44.59 34.31,45.05 34.31,47.1 IC5.5 | 26.77,41.62 30.88,41.62 32.94,43.68 32.94,44.59 | 26.77,41.62 26.08,41.62 C12.2 | 25.17,25.39 26.54,24.02 26.54,23.56 R12.1 26.77,23.33 29.05,21.04 29.05,16.93 | 25.17,25.39 25.17,30.64 26.54,32.02 R9.1 26.77,32.25 26.77,41.62 | 29.05,16.93 29.05,12.81 X23.2 | 26.77,41.62 C12.2 | 47.34,47.33 49.17,45.5 49.17,44.82 C17.2 | 47.34,47.33 44.83,49.85 42.54,49.85 42.08,49.39 42.08,47.33 IC5.15 | R34.2 44.14,60.13 44.14,58.08 42.77,56.71 X14.2 42.54,56.48 37.51,51.45 37.51,47.33 IC5.9 37.51,47.1 37.51,46.19 39.8,43.9 43.91,43.9 47.34,47.33
  Bottom 0.254: R33.2 25.39,60.13 25.39,57.85 24.25,56.71 X13.2 | R32.2 7.11,60.13 7.11,57.62 6.19,56.71 X12.2 5.96,56.48 5.96,50.3 5.28,49.62 5.28,46.19 8.71,42.76 R31.2 8.93,42.53 11.45,42.53 12.59,41.39 X11.2 12.82,41.39 25.85,41.39 C12.2 | 120.03,16.47 120.03,18.76 R6.1 120.03,18.99 v121.18,20.13 | 120.03,16.47 123.69,12.81 X28.2 | 120.03,16.47 116.38,12.81 105.63,12.81 X27.2 | R18.1 51,32.47 52.14,31.33 52.14,28.82 51,27.67 51,26.3 R15.1 51,26.07 52.6,24.47 52.6,22.19 47.8,17.39 47.8,16.93 | 47.8,16.93 47.8,12.81 X24.2 | R36.2 83,60.59 83,58.08 81.63,56.71 X16.2 | 65.86,59.22 65.17,59.91 R35.2 | 65.86,59.22 66.31,58.76 70.89,58.76 78.2,51.45 78.2,47.33 IC7.15 | 65.86,59.22 65.86,58.99 63.57,56.71 X15.2 | 33.85,39.1 32.94,39.1 32.71,38.87 32.71,37.96 IC5.34 | 33.85,39.1 34.08,38.87 34.08,37.96 IC5.32 | 36.6,39.1 36.6,37.96 IC5.29 | 36.6,39.1 35.22,40.47 34.31,40.47 33.85,40.02 33.85,39.1 | IC7.34 68.83,37.73 68.83,36.82 69.06,36.59 69.97,36.59 70.2,36.82 70.2,37.73 IC7.32 70.43,37.96 70.43,38.87 70.66,39.1 | 70.66,39.1 72.49,39.1 72.71,38.87 72.71,37.96 IC7.29 | IC7.3 68.83,47.33 68.83,48.25 69.29,48.7 69.97,48.7 70.2,48.48 70.2,47.33 IC7.5 70.43,47.1 v70.43,45.28 | v73.63,45.28 73.63,47.1 IC7.9 | v70.66,40.47 70.66,39.1 | v37.05,39.56 36.6,39.1 | 47.8,16.93 29.05,16.93
  pour Top: 110.41,42.56 120.89,42.56 120.89,27 110.41,27
  pour Top: 1.61,72.09 145.44,72.09 145.44,1.6 1.61,1.6
  pour Bottom: 1.61,72.09 145.44,72.09 145.44,1.6 1.61,1.6
LATCH  (via drill 0.61)
  Top 0.254: v99.69,32.93 99.69,34.3 IC1.32
  Bottom 0.254: IC7.21 79.34,37.96 79.34,39.79 80.26,40.7 86.2,40.7 93.97,32.93 v99.69,32.93 100.6,32.02 100.6,31.1 100.15,30.64 95.58,30.64 90.77,25.84 | 90.77,25.84 60.14,25.84 52.14,33.85 46.2,33.85 43,37.05 43,37.73 IC5.21 | 90.77,25.84 90.77,21.73 109.98,2.53 141.98,2.53 143.58,4.13 JP8.6
N$1
  Bottom 0.254: C23.1 50.31,53.05 50.08,53.28 50.08,56.48 SJ4.2 49.86,56.71 49.86,57.16 47.34,59.68 47.34,60.13 R34.1 | IC5.10 38.2,47.33 38.2,48.25 41.62,51.68 49.17,51.68 50.31,52.82 C23.1 | IC7.10 74.31,47.33 74.31,48.25 71.11,51.45 55.11,51.45 53.74,52.82 50.54,52.82 C23.1
N$2
  Top 0.254: IC1.7 101.06,40.7 104.03,40.7 105.63,39.1 Q1.2 105.63,38.87 104.49,37.73 104.49,34.07 C5.1
N$3
  Top 0.254: IC1.8 101.06,41.62 103.12,41.62 105.63,44.13 Q1.1 105.63,44.36 104.72,45.28 104.72,49.39 C3.1
N$4  (via drill 0.61)
  Top 0.254: v96.03,36.59 93.52,39.1 92.6,39.1 IC1.20
  Bottom 0.254: v96.03,36.59 98.77,33.85 103.12,33.85 104.03,32.93 107.46,32.93 107.92,33.39 107.92,34.53 107,35.45 102.2,35.45 100.6,37.05 C4.2
N$5
  Top 0.254: SL1.3 139.7,15.1 139.7,21.27 SL2.3 139.7,21.5 133.06,21.5 130.55,24.02 | 130.55,24.02 130.55,24.7 IC3.3 130.55,24.02 | 130.55,24.02 127.35,20.82 125.52,20.82 JP3.1
  Bottom 0.254: R2.2 126.21,28.13 126.21,24.7 127.12,23.79 127.12,22.42 125.52,20.82 JP3.1
N$6
  Top 0.254: IC1.16 93.75,43.22 93.75,48.02 92.37,49.39 JP6.1
N$7
  Top 0.254: D1.A 141.75,57.85 139.7,59.91 139.7,68.14 142.21,70.65 X1.-1
N$8  (via drill 0.61)
  Top 0.254: JP6.2 92.15,51.9 90.77,50.53 90.77,41.85 91.69,40.93 92.37,40.93 IC1.18 92.6,40.93 v96.03,40.93 | IC1.4 100.83,38.42 100.38,38.42 99.92,38.87 99.92,39.56 100.15,39.79 100.83,39.79 IC1.6 101.06,39.79 v102.43,39.79
  Bottom 0.254: 102.66,40.02 106.78,35.9 107.23,35.9 108.38,34.76 108.38,32.7 104.03,28.36 JP1.1 | 102.66,40.02 102.43,40.25 100.6,40.25 C10.1 100.38,40.47 99.23,41.62 96.72,41.62 v96.03,40.93 | 102.66,40.02 v102.43,39.79
N$9
  Top 0.254: IC1.17 92.37,41.62 92.37,47.79 91.23,48.93 91.23,50.08 91.92,50.76 93.52,50.76 94.66,49.62 JP6.3
N$10
  Top 0.254: IC1.14 95.58,43.22 95.58,43.68 96.03,44.13 98.32,44.13 100.15,45.96 JP5.1
N$11
  Top 0.254: IC1.15 94.89,43.22 94.89,43.9 95.58,44.59 95.8,44.59 96.26,45.05 96.26,50.53 94.89,51.9 JP6.4
N$12  (via drill 0.61)
  Top 0.254: v139.24,34.07 138.09,32.93 138.09,32.47 IC9.5
  Bottom 0.254: v139.24,34.07 139.92,34.76 139.92,36.13 C7.2
N$13
  Top 0.254: IC3.1 133.06,24.93 133.06,25.84 132.38,26.53 122.55,26.53 118.66,22.64 JP2.2
  Bottom 0.254: R1.1 136.04,28.13 135.35,28.13 134.21,29.27 129.87,29.27 128.95,28.36 R2.1 128.72,28.36 128.04,28.36 126.89,29.5 120.95,29.5 118.66,27.22 118.66,22.64 JP2.2
N$14
  Top 0.254: SL1.2 142.21,15.1 142.21,21.27 SL2.2 142.21,21.5 140.38,23.33 136.49,23.33 136.27,23.1 JP4.1 136.04,23.1 133.06,23.1 132.15,24.02 132.15,24.7 IC3.2
  Bottom 0.254: R1.2 133.29,27.9 133.29,25.84 136.04,23.1 JP4.1
N$15
  Top 0.254: IC9.14 135.35,38.42 135.35,36.82 132.15,33.62 132.15,31.33 136.27,27.22 139.7,27.22 SL3.3
N$16  (via drill 0.61)
  Top 0.254: v135.35,34.07 134.44,33.16 134.44,32.47 IC9.2
  Bottom 0.254: v135.35,34.07 134.44,34.99 132.15,34.99 C8.2
N$17
  Bottom 0.254: R33.1 28.59,60.36 31.11,57.85 31.11,57.16 SJ3.2 31.34,57.16 31.34,52.59 31.79,52.13 C22.1 32.02,51.9 32.94,51.9 36.6,48.25 36.6,47.33 IC5.8 36.6,47.1 36.6,46.42 39.57,43.45 59.91,43.45 66.08,49.62 71.34,49.62 72.71,48.25 72.71,47.33 IC7.8
N$18
  Top 0.254: R7.2 18.54,32.25 18.54,31.33 12.82,25.62 X21.1
N$19  (via drill 0.61)
  Top 0.254: v29.74,32.25 21.51,32.25 R7.1
  Bottom 0.254: v29.74,32.25 31.34,32.25 R8.2 31.57,32.25 35,32.25 IC6.14
N$20
  Top 0.254: IC9.8 141.98,32.25 141.98,27.44 142.21,27.22 SL3.2
N$21
  Bottom 0.254: R9.2 26.77,29.5 31.34,29.5 R8.1 31.57,29.5 33.17,31.1 35,31.1 IC6.13
N$22  (via drill 0.61)
  Top 0.254: v137.64,34.53 137.64,33.85 136.95,33.16 136.95,32.47 IC9.4
  Bottom 0.254: v137.64,34.53 137.41,34.76 137.41,36.13 C7.1
N$23
  Top 0.254: R10.2 21.28,19.21 14.88,19.21 8.48,12.81 X22.1
N$25
  Bottom 0.254: R6.2 117.06,18.99 117.52,18.99 120.95,22.42 JP2.1 120.95,22.64 120.03,23.56 120.03,25.84 R5.1
N$26  (via drill 0.61)
  Top 0.254: v28.37,23.33 24.48,19.44 R10.1
  Bottom 0.254: v28.37,23.33 31.11,23.33 R11.2 31.34,23.56 32.48,24.7 35,24.7 IC6.8
N$27
  Bottom 0.254: R12.2 26.77,26.3 31.11,26.3 R11.1 31.34,26.07 35,26.07 IC6.9
N$28
  Top 0.254: R13.2 31.79,18.99 31.79,17.84 26.77,12.81 X23.1
N$29  (via drill 0.61)
  Top 0.254: v140.61,30.42 139.47,31.56 139.47,32.25 IC9.6
  Bottom 0.254: v140.61,30.42 141.3,31.1 141.3,37.5 139.47,39.33 139.47,42.07 C9.1
N$30  (via drill 0.61)
  Top 0.254: v29.97,47.33 40.03,47.33 42.54,49.85 61.51,49.85 v64.94,46.42
  Bottom 0.254: v29.97,47.33 30.88,47.33 IC5.1 | v64.94,46.42 66.31,46.42 66.77,45.96 67.69,45.96 67.91,46.19 67.91,47.1 IC7.2
N$31  (via drill 0.61)
  Top 0.254: v35,20.82 35,19.21 R13.1
  Bottom 0.254: v35,20.82 36.37,20.82 40.25,24.7 IC6.7 40.48,24.7 43,22.19 51.91,22.19 52.14,22.42 52.14,24.24 51.68,24.7 50.08,24.7 48.71,26.07 45.74,26.07 R14.2
N$32
  Bottom 0.254: R15.2 50.77,23.33 45.74,23.33 R14.1 45.74,23.56 43.45,25.84 40.48,25.84 IC6.6
N$33
  Top 0.254: L1.1 136.49,54.19 135.35,54.19 131.92,57.62 D1.C
  Bottom 0.254: 118.66,44.82 118.66,39.79 C1.1 | 118.66,44.82 118.21,45.28 IC4.1 118.66,44.82 | 118.66,44.82 125.52,51.68 125.75,51.68 131.69,57.62 D1.C
N$34  (via drill 0.61)
  Top 0.254: v120.26,35.9 120.26,31.1 116.61,27.44 114.32,27.44 111.8,29.96 99.23,29.96 98.09,31.1 98.09,34.3 IC1.30 | IC9.9 141.75,38.65 141.75,39.33 140.15,40.93 125.29,40.93 123.92,39.56 JP7.1
  Bottom 0.254: v120.26,35.9 123.69,39.33 JP7.1
N$35
  Top 0.254: X26.1 81.17,16.01 81.17,18.99 R22.2
N$36
  Top 0.254: R22.1 78.2,19.21 77.74,19.21 72.26,24.7 IC8.7 72.03,24.7 70.89,23.56 66.54,23.56 R23.2
N$37
  Top 0.254: R24.2 61.97,26.3 66.31,26.3 R23.1 66.54,26.07 72.03,26.07 IC8.6
N$38  (via drill 0.61)
  Top 0.254: v43.91,32.02 43.45,31.56 43.45,19.21 R16.1
  Bottom 0.254: R17.2 45.74,32.47 45.28,32.02 v43.91,32.02 43.68,32.25 40.48,32.25 IC6.1
N$39
  Top 0.254: R16.2 46.2,18.99 46.2,13.73 45.28,12.81 X24.1
N$40
  Bottom 0.254: 45.74,29.73 50.77,29.73 R18.2 | 45.74,29.73 44.37,31.1 40.48,31.1 IC6.2 | 45.74,29.73 R17.1
N$41
  Top 0.254: R27.2 88.49,26.53 83.69,26.53 R26.1 83.46,26.3 83.23,26.07 77.29,26.07 IC8.9
N$42
  Top 0.254: R21.2 61.97,29.73 66.31,29.73 R20.1 66.54,29.73 67.91,31.1 72.03,31.1 IC8.2
N$43
  Top 0.254: R19.1 63.57,19.21 64.03,19.21 65.17,20.36 74.77,20.36 77.52,17.61 79.12,17.61 79.57,18.07 79.57,20.36 73.63,26.3 73.63,31.56 72.94,32.25 72.26,32.25 IC8.1 72.03,32.47 66.54,32.47 R20.2
N$44
  Top 0.254: IC1.31 98.77,34.3 98.77,31.1 99.23,30.64 111.58,30.64 117.75,36.82 123.69,36.82 JP7.2 123.92,37.05 127.35,40.47 138.09,40.47 139.24,39.33 139.24,38.65 IC9.11
N$45
  Top 0.254: R19.2 66.08,18.99 66.08,12.81 X25.1
N$46
  Top 0.254: R25.2 92.37,18.99 96.72,18.99 102.89,12.81 X27.1
N$47
  Top 0.254: IC8.8 77.29,24.7 78.2,23.79 83.46,23.79 R26.2 83.69,23.56 88.03,19.21 89.4,19.21 R25.1
N$48  (via drill 0.61)
  Top 0.254: v133.98,34.07 133.06,33.16 133.06,32.47 IC9.1
  Bottom 0.254: v133.98,34.07 133.98,31.56 C6.1
N$49
  Top 0.254: R28.2 106.09,18.99 115.01,18.99 121.18,12.81 X28.1
N$50
  Top 0.254: IC8.14 77.29,32.47 83.46,32.47 R29.2 83.69,32.47 84.83,31.33 89.17,31.33 101.29,19.21 102.89,19.21 R28.1
N$51
  Top 0.254: R30.2 88.49,29.73 83.69,29.73 R29.1 83.46,29.73 82.09,31.1 77.29,31.1 IC8.13
N$52  (via drill 0.61)
  Top 0.254: v135.58,29.96 135.58,32.25 IC9.3
  Bottom 0.254: v135.58,29.96 135.58,30.19 136.72,31.33 C6.2
N$53
  Bottom 0.254: IC5.35 31.79,37.73 31.79,36.36 35,33.16 36.37,33.16 36.83,32.7 36.83,30.87 35.91,29.96 35.22,29.96 IC6.12
N$54  (via drill 0.61)
  Top 0.254: v33.4,28.13 v33.4,36.13
  Bottom 0.254: v33.4,36.13 33.4,37.73 IC5.33 | v33.4,28.13 34.08,27.44 35,27.44 IC6.10
N$55  (via drill 0.61)
  Top 0.254: v36.6,35.45 42.08,29.96 v42.31,29.96
  Bottom 0.254: v36.6,35.45 35,37.05 35,37.73 IC5.31 | v42.31,29.96 43.23,29.04 43.23,28.13 42.54,27.44 40.48,27.44 IC6.5
N$56
  Bottom 0.254: IC5.28 37.51,37.73 37.51,32.02 39.57,29.96 40.25,29.96 IC6.3
N$57
  Top 0.254: L1.2 142.21,53.96 142.21,48.02 143.35,46.88 DC1.1
  Bottom 0.254: C14.1 143.35,50.99 143.35,46.88 DC1.1
N$58  (via drill 0.61)
  Top 0.254: v67.46,36.13 63.34,32.02 63.34,31.79 62.43,30.87 60.83,30.87 60.6,30.64 60.6,28.82 61.06,28.36 68.6,28.36 69.97,29.73 72.03,29.73 IC8.3
  Bottom 0.254: v67.46,36.13 67.91,36.59 67.91,37.73 IC7.35
N$59
  Bottom 0.254: 12.82,45.96 12.82,43.9 X11.1 | 12.82,45.96 12.82,46.42 SJ1.1 | 12.82,45.96 17.16,45.96 C20.2
N$60  (via drill 0.61)
  Top 0.254: v43,48.93 45.74,46.19 63.11,46.19 64.26,45.05 68.83,45.05 69.97,46.19 77.74,46.19 v78.43,45.5 79.8,44.13 v80.72,44.13
  Bottom 0.254: C26.1 107.46,53.05 107,53.5 107,56.48 SJ7.2 107,56.71 104.49,59.22 | 104.49,59.22 104.49,60.13 R37.1 | v43,48.93 43,47.33 IC5.16 | v78.43,45.5 79.12,46.19 79.12,47.1 IC7.16 | 104.49,59.22 103.35,59.22 100.83,56.71 100.83,56.02 98.09,53.28 91.92,53.28 90.55,51.9 90.55,51.68 83,44.13 v80.72,44.13
N$61  (via drill 0.61)
  Top 0.254: v69.51,33.39 v69.51,39.56 | v68.83,27.22 72.03,27.22 IC8.5
  Bottom 0.254: v69.51,39.56 69.51,37.96 IC7.33 | v69.51,33.39 69.51,29.96 68.83,29.27 v68.83,27.22
N$62  (via drill 0.61)
  Top 0.254: v71.34,36.13 71.8,36.13 75.23,32.7 75.23,28.59 76.37,27.44 77.06,27.44 IC8.10
  Bottom 0.254: v71.34,36.13 71.34,37.73 IC7.31
N$63  (via drill 0.61)
  Top 0.254: v73.4,39.56 73.4,35.22 75.69,32.93 75.69,30.64 76.37,29.96 77.06,29.96 IC8.12
  Bottom 0.254: v73.4,39.56 73.4,37.96 IC7.28
N$64
  Bottom 0.254: 14.19,55.33 14.19,53.28 14.42,53.05 C21.1 | 14.19,55.33 14.19,56.48 SJ2.1 | 14.19,55.33 11.91,55.33 10.76,56.48 8.71,56.48 X12.1
N$65
  Bottom 0.254: 29.05,57.16 27.22,57.16 26.77,56.71 X13.1 | 29.05,57.16 SJ3.1 | 29.05,57.16 29.05,52.13 C22.2
N$66  (via drill 0.61)
  Top 0.254: v67.46,44.13 64.26,44.13 62.66,45.73 33.62,45.73 v33.4,45.5
  Bottom 0.254: 17.16,48.7 16.71,48.25 13.05,48.25 SJ1.2 12.82,48.25 10.31,45.73 8.93,45.73 R31.1 | 17.16,48.7 17.85,48.02 27.68,48.02 28.37,48.7 32.94,48.7 33.4,48.25 33.4,47.33 IC5.4 33.4,47.1 v33.4,45.5 | 17.16,48.7 C20.1 | v67.46,44.13 69.51,46.19 69.51,47.1 IC7.4
N$67
  Bottom 0.254: 12.59,57.62 SJ2.2 | 12.59,57.62 10.08,60.13 R32.1 | 15.79,50.76 13.74,50.76 11.68,52.82 C21.2 | 15.79,50.76 25.62,50.76 | 25.62,50.76 32.48,50.76 35,48.25 35,47.33 IC5.6 | 25.62,50.76 25.62,56.93 26.77,58.08 26.77,61.05 30.2,64.48 71.34,64.48 73.4,62.42 73.4,59.91 83.46,49.85 83.46,48.25 79.12,43.9 72.94,43.9 71.34,45.5 71.34,47.1 IC7.6 | 12.59,57.62 13.28,57.62 13.51,57.85 14.65,57.85 15.79,56.71 15.79,50.76
N$68
  Bottom 0.254: 47.57,56.48 45.28,56.48 X14.1 | 47.57,56.48 48.26,56.48 SJ4.1 | 47.57,56.48 47.57,53.05 C23.2
N$69
  Bottom 0.254: 69.51,56.48 66.08,56.48 X15.1 | 69.51,56.48 69.74,56.48 SJ5.1 69.51,56.48 | 69.51,56.48 69.51,52.82 C24.2
N$70  (via drill 0.61)
  Top 0.254: v53.97,51.22 67.91,51.22 v70.89,54.19
  Bottom 0.254: 71.34,54.19 71.34,53.5 72.03,52.82 C24.1 72.26,52.59 72.26,52.13 75.91,48.48 75.91,47.33 IC7.12 | 71.34,54.19 71.34,56.48 SJ5.2 71.11,56.71 71.11,57.16 70.43,57.85 65.86,57.85 64.94,56.93 64.94,56.48 63.8,55.33 63.11,55.33 62.43,56.02 62.43,59.68 64.03,61.28 66.08,61.28 67.23,60.13 67.69,60.13 R35.1 | v53.97,51.22 42.54,51.22 39.8,48.48 39.8,47.33 IC5.12 | 71.34,54.19 v70.89,54.19
N$71
  Bottom 0.254: 86.66,56.48 84.37,56.48 X16.1 | 86.66,56.48 87.34,56.48 SJ6.1 | 86.66,56.48 86.66,52.82 C25.2
N$73
  Bottom 0.254: 104.72,56.48 102.43,56.48 X17.1 | 104.72,56.48 105.18,56.48 SJ7.1 | 104.72,56.48 104.72,53.05 C26.2
N$74
  Bottom 0.254: 122.09,56.48 120.72,56.48 X18.1 | 122.09,56.48 123.69,56.48 SJ8.1 | 122.09,56.48 122.09,53.05 C27.2
N$75  (via drill 0.61)
  Top 0.254: v45.97,47.33 62.66,47.33 64.48,45.5 68.6,45.5 72.03,48.93 v80.03,48.93 | v121.41,58.08 91.23,58.08 v82.55,49.39
  Bottom 0.254: C27.1 125.06,53.05 125.06,56.48 SJ8.2 125.06,56.71 125.06,57.16 122.78,59.45 | 122.78,59.45 122.78,60.13 R38.1 122.78,59.45 | v45.97,47.33 44.83,47.33 IC5.18 | 80.72,48.25 v80.03,48.93 | 80.72,48.25 80.72,47.33 IC7.18 | v121.41,58.08 122.78,59.45 | v82.55,49.39 81.86,49.39 80.72,48.25
N$76
  Top 0.254: DC1.4 135.81,46.88 132.61,50.08 118.44,50.08 L2.1
N$77  (via drill 0.61)
  Top 0.254: v62.43,50.3 v75.46,50.3 79.12,53.96 v80.72,53.96
  Bottom 0.254: C25.1 89.17,52.82 89.17,56.48 SJ6.2 88.94,56.71 88.94,57.16 85.97,60.13 | 85.97,60.13 85.97,60.59 R36.1 85.97,60.13 | v62.43,50.3 42.31,50.3 41.4,49.39 41.4,47.33 IC5.14 | v75.46,50.3 77.52,48.25 77.52,47.33 IC7.14 | 85.97,60.13 82.77,56.93 82.77,56.02 v80.72,53.96
RESET
  Top 0.254: IC1.29 97.17,34.53 97.17,39.1 101.52,43.45 101.52,47.1 99.23,49.39 97.4,49.39 JP6.5
SCL  (via drill 0.61)
  Top 0.254: 131.47,18.53 131.92,18.99 131.92,19.67 IC3.7 | 131.47,18.53 130.32,17.39 120.26,17.39 116.83,20.82 107.69,20.82 96.49,32.02 96.49,34.3 IC1.28 | 131.47,18.53 v132.15,17.84
  Bottom 0.254: 136.27,18.07 136.27,20.36 JP4.2 | 136.27,18.07 136.27,16.7 R4.2 | 136.27,18.07 132.38,18.07 v132.15,17.84
SDA  (via drill 0.61)
  Top 0.254: v95.58,28.59 95.58,34.3 IC1.27 | v128.27,18.3 128.49,18.07 129.87,18.07 130.55,18.76 130.55,19.67 IC3.6
  Bottom 0.254: v95.58,28.59 95.58,21.5 104.26,12.81 104.26,12.36 104.95,11.67 124.38,11.67 127.35,14.64 127.35,16.47 | v128.27,18.3 128.27,17.39 127.58,16.7 R3.2 127.35,16.47 | 127.35,16.47 123.46,20.36 123.46,21.27 125.29,23.1 JP3.2
VDD  (via drill 0.61)
  Top 0.254: IC9.16 132.84,38.42 118.89,24.47 117.75,24.47 JP2.3 115.92,22.42 119.12,19.21 121.63,19.21 122.09,19.67 129.18,19.67 IC3.5 129.41,19.9 129.41,20.36 130.32,21.27 132.38,21.27 133.06,20.59 133.06,19.9 IC3.8 133.29,19.67 133.29,13.04 141.07,5.27 141.07,4.36 JP8.5 | v42.31,28.59 C19.2 39.34,28.59 39.34,29.96 35.68,33.62 35.68,39.56 36.83,40.7 v36.83,40.93 36.83,42.3 | v30.42,44.36 34.77,44.36 36.83,42.3 | 40.25,44.13 38.65,44.13 36.83,42.3 | 40.25,44.13 61.29,44.13 C13.1 61.51,44.13 62.89,44.13 v63.11,43.9 | 40.25,44.13 v40.25,44.82 | v70.2,28.59 IC8.4
  Bottom 0.254: R3.1 130.55,16.7 133.52,16.7 R4.1 133.75,16.47 133.75,12.59 141.07,5.27 141.07,4.36 JP8.5 | 33.17,43.22 35.68,45.73 35.68,47.1 IC5.7 | 33.17,43.22 31.11,41.16 31.11,37.96 IC5.36 | 33.17,43.22 35.45,40.93 v36.83,40.93 37.05,40.93 38.2,39.79 38.2,37.96 IC5.27 | 40.25,45.96 39.34,45.96 39.11,46.19 39.11,47.1 IC5.11 | 40.25,45.96 40.48,46.19 40.48,47.1 IC5.13 | 40.25,45.96 43.45,45.96 43.68,46.19 43.68,47.1 IC5.17 | IC6.4 v42.31,28.59 | v30.42,44.36 26.08,44.36 C12.1 | v40.25,44.82 40.25,45.96 | 75,45.96 75,47.1 IC7.11 | 75,45.96 75,45.28 74.09,44.36 73.17,44.36 72.03,45.5 72.03,47.1 IC7.7 71.8,47.33 71.8,48.48 71.11,49.16 66.31,49.16 64.03,46.88 64.03,45.73 64.48,45.28 | 76.37,45.96 76.6,46.19 76.6,47.1 IC7.13 | 75,45.96 76.37,45.96 | 76.37,45.96 77.74,44.59 78.89,44.59 79.8,45.5 79.8,47.1 IC7.17 | 69.06,40.7 69.74,41.39 72.94,41.39 74.31,40.02 | 69.06,40.7 67.23,38.87 67.23,37.96 IC7.36 | 74.31,40.02 74.31,37.96 IC7.27 74.31,37.73 74.31,36.82 73.63,36.13 73.63,28.59 C218.2 v70.2,28.59 | 74.31,40.02 75.46,41.16 86.43,41.16 87.8,39.79 89.4,39.79 C11.1 89.63,39.79 90.09,39.79 92.37,42.07 110.66,42.07 | 69.06,40.7 64.48,45.28 | 110.66,42.07 110.66,42.99 112.95,45.28 IC4.3 | 110.66,42.07 110.66,39.79 C2.1 110.66,39.56 110.66,28.13 | 116.83,26.07 120.72,29.96 124.15,29.96 129.18,34.99 C8.1 | 110.66,28.13 113.86,28.13 115.92,26.07 | 110.66,28.13 106.55,28.13 JP1.2 | 116.83,26.07 115.92,26.07 | 116.83,26.07 R5.2 | 64.48,45.28 v63.11,43.9 | 115.92,26.07 JP2.3
VSS  (via drill 0.61)
  Top 0.254: 36.37,28.82 36.6,28.59 C19.1 36.37,28.82 | 36.37,28.82 34.77,30.42 v34.77,39.56 34.77,40.7 v35.91,41.85 | 36.37,28.82 v37.74,30.19 | v80.72,39.79 85.06,44.13 C16.1 85.29,44.36 85.29,47.33 95.58,57.62 105.41,57.62 112.72,50.3 L2.2 112.95,50.3 114.78,52.13 119.58,52.13 120.72,50.99 v126.44,50.99 | IC8.11 78.2,28.59 v79.12,29.5
  Bottom 0.254: v34.77,39.56 35,39.56 35.68,38.87 35.68,37.96 IC5.30 | IC6.11 36.14,28.59 v37.74,30.19 | 72.26,35.22 72.26,32.02 69.29,29.04 69.29,28.13 70.2,27.22 74.77,27.22 76.14,28.59 C218.1 76.37,28.59 78.2,30.42 | 72.26,35.22 72.26,36.59 72.03,36.82 72.03,37.73 IC7.30 | 78.2,30.42 80.72,32.93 80.72,37.73 IC7.19 80.72,37.96 v80.72,39.79 | 78.2,30.42 v79.12,29.5 | 72.26,35.22 67,35.22 60.6,41.62 49.4,41.62 C17.1 49.17,41.62 45.51,37.96 44.83,37.96 IC5.19 44.6,37.96 44.6,38.65 41.4,41.85 v35.91,41.85 | v126.44,50.99 130.09,50.99 C15.1 130.32,50.76 131.92,49.16 131.92,38.87 138.09,32.7 138.09,14.19 141.07,11.21 141.07,9.39 JP8.1
WR  (via drill 0.61)
  Top 0.254: 100.6,32.47 100.6,34.99 99.92,35.67 99.92,36.36 100.15,36.59 100.83,36.59 IC1.2 | v99.69,31.56 100.6,32.47 | v81.63,33.39 v79.8,35.22 | 100.6,32.47 v101.52,31.56
  Bottom 0.254: 82.55,31.56 v99.69,31.56 | 82.55,31.56 77.29,26.3 60.37,26.3 50.08,36.59 44.14,36.59 43.91,36.82 43.91,37.73 IC5.20 | v79.8,35.22 79.8,37.73 IC7.20 | v81.63,33.39 81.63,32.47 82.55,31.56 | v101.52,31.56 101.52,31.33 100.38,30.19 95.8,30.19 94.66,29.04 94.66,19.44 102.89,11.21 107.46,11.21 115.69,2.98 141.52,2.98 142.44,3.9 142.44,4.58 143.58,5.73 143.58,6.64 JP8.4

### Text on the board
Top: 1 | 1
Bottom: 1 | 1 | DK1RI | V02.0 | 1 | 8x8Koppelpunkt